# EAGLE design ADC Arduino Uno Shield (EAGLE 9.6.2)
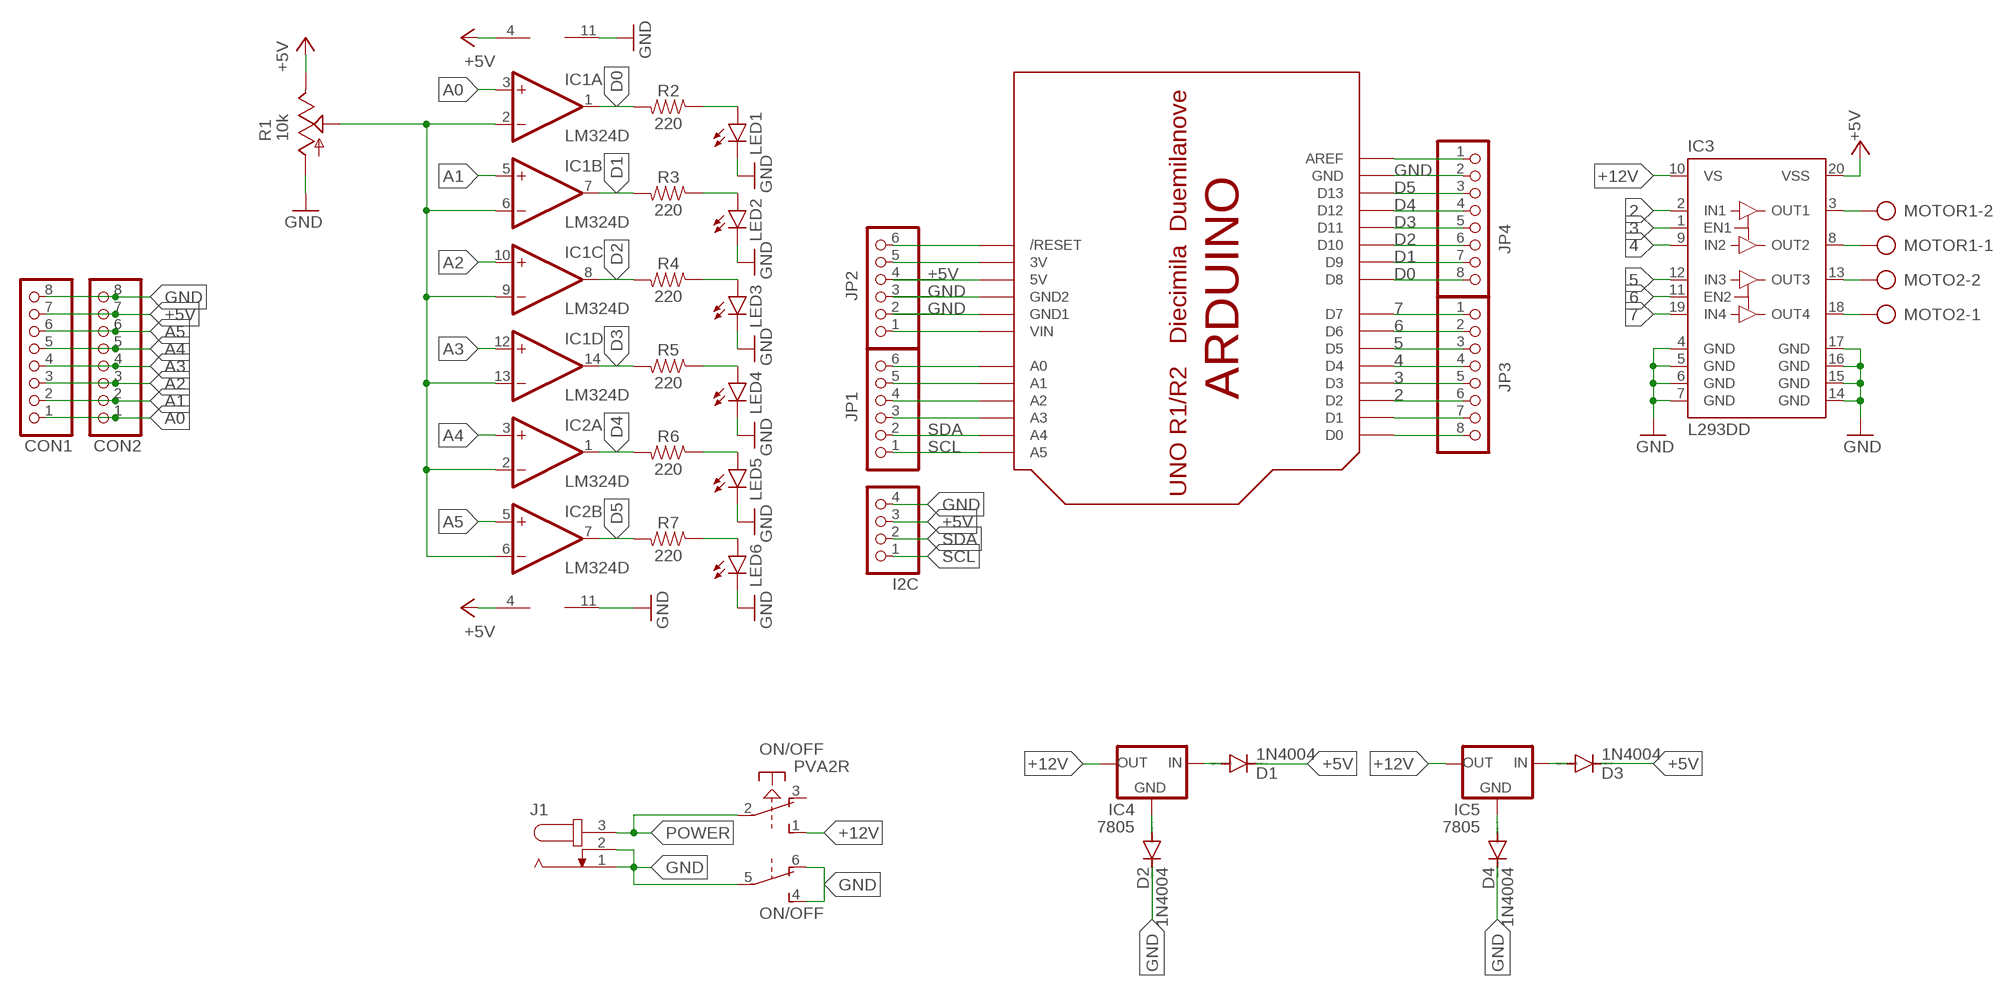
[diagram p0: schematic, sheet 1]

## Parts
CON1  PINHD-1X8  [1X08]
CON2  PINHD-1X8  [1X08]
D1  1N4004  [DO41-10]
D2  1N4004  [DO41-10]
D3  1N4004  [DO41-10]
D4  1N4004  [DO41-10]
I2C  PINHD-1X4  [1X04]
IC1  LM324D  [SO14]
IC2  LM324D  [SO14]
IC3  L293DD  [SO20]
IC4  7805  78XXS  [78XXS]
IC5  7805  78XXS  [78XXS]
J1  JACK-PLUG0  [SPC4077]
JP1  PINHD-1X6  [1X06]
JP2  PINHD-1X6  [1X06]
JP3  PINHD-1X8  [1X08]
JP4  PINHD-1X8  [1X08]
LED1  LEDSML0805  [SML0805]
LED2  LEDSML0805  [SML0805]
LED3  LEDSML0805  [SML0805]
LED4  LEDSML0805  [SML0805]
LED5  LEDSML0805  [SML0805]
LED6  LEDSML0805  [SML0805]
MOTO2  AK500/2-H  [AK500/2-H]
MOTOR1  AK500/2-H  [AK500/2-H]
ON/OFF  PVA2R  [PVA2R]
R1  10k  TRIM_US-CA9V  [CA9V]
R2  220  RESISTOR1206  [1206]
R3  220  RESISTOR1206  [1206]
R4  220  RESISTOR1206  [1206]
R5  220  RESISTOR1206  [1206]
R6  220  RESISTOR1206  [1206]
R7  220  RESISTOR1206  [1206]
U$2  ARDUINO-NODIM  [ARDUINO-NODIM]

## Nets
2: IC3.2(IN1) JP3.6 U$2.D2
3: IC3.1(EN1) JP3.5 U$2.D3
4: IC3.9(IN2) JP3.4 U$2.D4
5: IC3.12(IN3) JP3.3 U$2.D5
6: IC3.11(EN2) JP3.2 U$2.D6
7: IC3.19(IN4) JP3.1 U$2.D7
+5V: CON1.7 CON2.7 D1.C D3.C I2C.3 IC1.4(P:V+) IC2.4(P:V+) IC3.20(VSS) JP2.4 R1.E U$2.5V
+12V: IC3.10(VS) IC4.OUT IC5.OUT ON/OFF.1(1:S)
A0: CON1.1 CON2.1 IC1.3(A:+IN)
A1: CON1.2 CON2.2 IC1.5(B:+IN)
A2: CON1.3 CON2.3 IC1.10(C:+IN)
A3: CON1.4 CON2.4 IC1.12(D:+IN)
A4: CON1.5 CON2.5 IC2.3(A:+IN)
A5: CON1.6 CON2.6 IC2.5(B:+IN)
D0: IC1.1(A:OUT) JP4.8 R2.2 U$2.D8
D1: IC1.7(B:OUT) JP4.7 R3.2 U$2.D9
D2: IC1.8(C:OUT) JP4.6 R4.2 U$2.D10
D3: IC1.14(D:OUT) JP4.5 R5.2 U$2.D11
D4: IC2.1(A:OUT) JP4.4 R6.2 U$2.D12
D5: IC2.7(B:OUT) JP4.3 R7.2 U$2.D13
GND: CON1.8 CON2.8 D2.C D4.C I2C.4 IC1.11(P:V-) IC2.11(P:V-) IC3.4(GND) IC3.5(GND) IC3.6(GND) IC3.7(GND) IC3.14(GND) IC3.15(GND) IC3.16(GND) IC3.17(GND) J1.1 J1.2 JP2.2 JP2.3 JP4.2 LED1.C LED2.C LED3.C LED4.C LED5.C LED6.C ON/OFF.4(2:S) ON/OFF.5(2:P) ON/OFF.6(2:O) R1.A U$2.GND U$2.GND1 U$2.GND2
N$1: D1.A IC4.IN
N$2: JP1.3 U$2.A3
N$3: D2.A IC4.GND
N$4: D3.A IC5.IN
N$5: D4.A IC5.GND
N$6: JP1.4 U$2.A2
N$7: LED1.A R2.1
N$8: LED2.A R3.1
N$9: LED3.A R4.1
N$10: LED4.A R5.1
N$11: LED5.A R6.1
N$12: LED6.A R7.1
N$13: IC1.2(A:-IN) IC1.6(B:-IN) IC1.9(C:-IN) IC1.13(D:-IN) IC2.2(A:-IN) IC2.6(B:-IN) R1.S
N$14: JP1.5 U$2.A1
N$15: IC3.3(OUT1) MOTOR1.2
N$16: IC3.8(OUT2) MOTOR1.1
N$17: IC3.13(OUT3) MOTO2.2
N$18: IC3.18(OUT4) MOTO2.1
N$19: JP1.6 U$2.A0
N$21: JP4.1 U$2.AREF
N$22: JP3.7 U$2.D1
N$23: JP3.8 U$2.D0
POWER: J1.3 ON/OFF.2(1:P)
SCL: I2C.1 JP1.1 U$2.A5
SDA: I2C.2 JP1.2 U$2.A4
U$2_3V: JP2.5 U$2.3V
U$2_/RESET: JP2.6 U$2.RESET(/RESET)
U$2_VIN: JP2.1 U$2.VIN
Unconnected: IC2.8(C:OUT) IC2.9(C:-IN) IC2.10(C:+IN) IC2.12(D:+IN) IC2.13(D:-IN) IC2.14(D:OUT) ON/OFF.3(1:O)

## Library data of the parts
CON1 CON2 = Connector:PINHD-1X8: PIN HEADER; CATEGORY: CONNECTOR; SUB-CATEGORY: PIN-HEADER
D1-D4 = diode:1N4004: DIODE general purpose rectifier, 1 A
I2C = Connector:PINHD-1X4: PIN HEADER; CATEGORY: CONNECTOR; SUB-CATEGORY: PIN-HEADER
IC1 IC2 = linear:LM324: OP AMP
IC3 = st-microelectronics:L293DD: PUSH-PULL FOUR CHANNEL DRIVER WITH DIODES Source: http://www.st.com/stonline/books/pdf/docs/1330.pdf; OC_FARNELL: unknown
IC4 IC5 = v-reg:78XXS: VOLTAGE REGULATOR
J1 = con-jack:JACK-PLUG: DC POWER JACK Power Jack, DC, Right Angle, Through Hole, Rated 5A at 16VDC, PC Terminals Distributor: Farnell (www.Farnell.de) Drawing: 84N1161.pdf / 84N1162.pdf Manufacturer: SPC Technology (www.spctechnology.com) Type: SPC4077 / SPC 4078; OC_FARNELL: unknown; OC_NEWARK: unknown
JP1 JP2 = pinhead:PINHD-1X6: PIN HEADER
JP3 JP4 = pinhead:PINHD-1X8: PIN HEADER
LED1-LED6 = led:LED: LED OSRAM: - CHIPLED LG R971, LG N971, LY N971, LG Q971, LY Q971, LO R971, LY R971 LH N974, LH R974 LS Q976, LO Q976, LY Q976 LO Q996 - Hyper CHIPLED LW Q18S LB Q993, LB Q99A, LB R99A - SideLED LS A670, LO A670, LY A670, LG A670, LP A670 LB A673, LV A673, LT A673, LW A673 LH A674 LY A675 LS A676, LA A676, LO A676, LY A676, LW A676 LS A679, LY A679, LG A679 - Hyper Micro SIDELED® LS Y876, LA Y876, LO Y876, LY Y876 LT Y87S - SmartLED LW L88C, LW L88S LB L89C, LB L89S, LG L890 LS L89K, LO L89K, LY L89K LS L896, LA L896, LO L896, LY L896 - TOPLED LS T670, LO T670, LY T670, LG T670, LP T670 LSG T670, LSP T670, LSY T670, LOP T670, LYG T670 LG T671, LOG T671, LSG T671 LB T673, LV T673, LT T673, LW T673 LH T674 LS T676, LA T676, LO T676, LY T676, LB T676, LH T676, LSB T676, LW T676 LB T67C, LV T67C, LT T67C, LS T67K, LO T67K, LY T67K, LW E67C LS E67B, LA E67B, LO E67B, LY E67B, LB E67C, LV E67C, LT E67C LW T67C LS T679, LY T679, LG T679 LS T770, LO T770, LY T770, LG T770, LP T770 LB T773, LV T773, LT T773, LW T773 LH T774 LS E675, LA E675, LY E675, LS T675 LS T776, LA T776, LO T776, LY T776, LB T776 LHGB T686 LT T68C, LB T68C - Hyper Mini TOPLED® LB M676 - Mini TOPLED Santana® LG M470 LS M47K, LO M47K, LY M47K Source: http://www.osram.convergy.de LUXEON: - LUMILED® LXK2-PW12-R00, LXK2-PW12-S00, LXK2-PW14-U00, LXK2-PW14-V00 LXK2-PM12-R00, LXK2-PM12-S00, LXK2-PM14-U00 LXK2-PE12-Q00, LXK2-PE12-R00, LXK2-PE12-S00, LXK2-PE14-T00, LXK2-PE14-U00 LXK2-PB12-K00, LXK2-PB12-L00, LXK2-PB12-M00, LXK2-PB14-N00, LXK2-PB14-P00, LXK2-PB14-Q00 LXK2-PR12-L00, LXK2-PR12-M00, LXK2-PR14-Q00, LXK2-PR14-R00 LXK2-PD12-Q00, LXK2-PD12-R00, LXK2-PD12-S00 LXK2-PH12-R00, LXK2-PH12-S00 LXK2-PL12-P00, LXK2-PL12-Q00, LXK2-PL12-R00 Source: www.luxeon.com KINGBRIGHT: KA-3528ASYC Source: www.kingbright.com
MOTO2 MOTOR1 = con-ptr500:AK500/2-H: CONNECTOR Aug. 2004 / PTR Meßtechnik: Die Bezeichnung der Serie AK505 wurde geändert. Es handelt sich hierbei um AK500 in horizontaler Ausführung.; OC_FARNELL: unknown; OC_NEWARK: unknown
ON/OFF = switch-misc:PVA2R: ITT SWITCH
R1 = pot:TRIM_US-: POTENTIOMETER
R2-R7 = SparkFun-Resistors:RESISTOR: Generic Resistor Package
U$2 = adafruit:ARDUINO: Arduino Diecimila/Duemilanove Make a shield with ease, this package has all the named pins as well as the two mounting drill holes and an outline of the USB and DC power connector. The outline is on the DIMENSION layer, so if your board house uses it they will cut the outline to match. http://www.ladyada.net/library/pcb/eaglelibrary.html

## Board
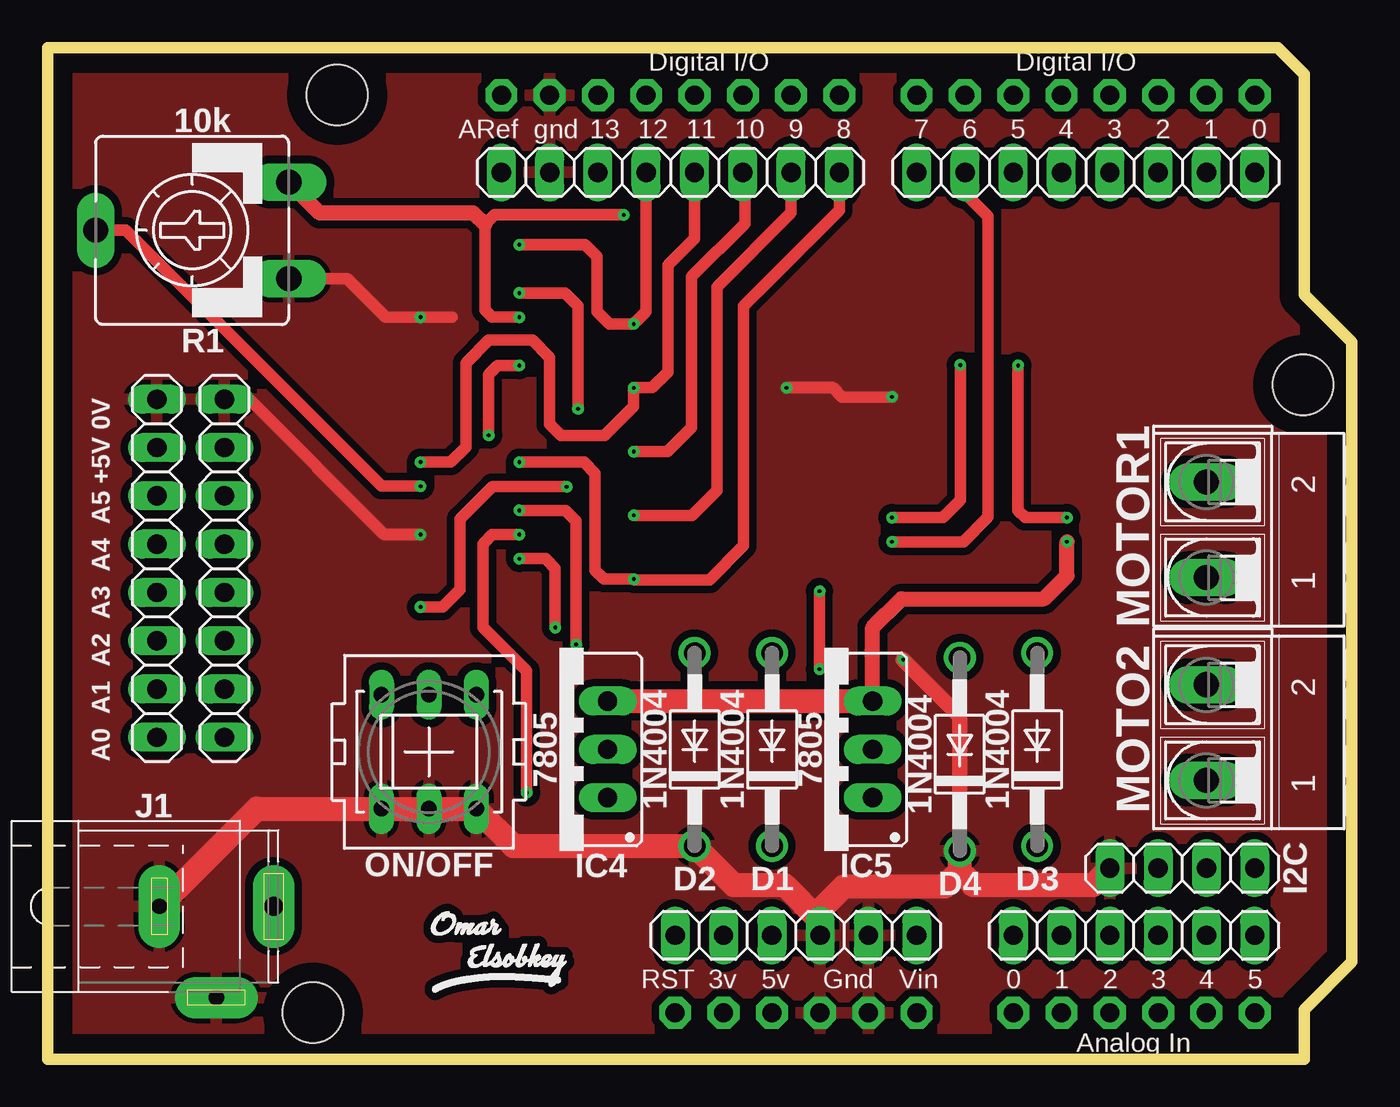
[diagram p1: board, top side]
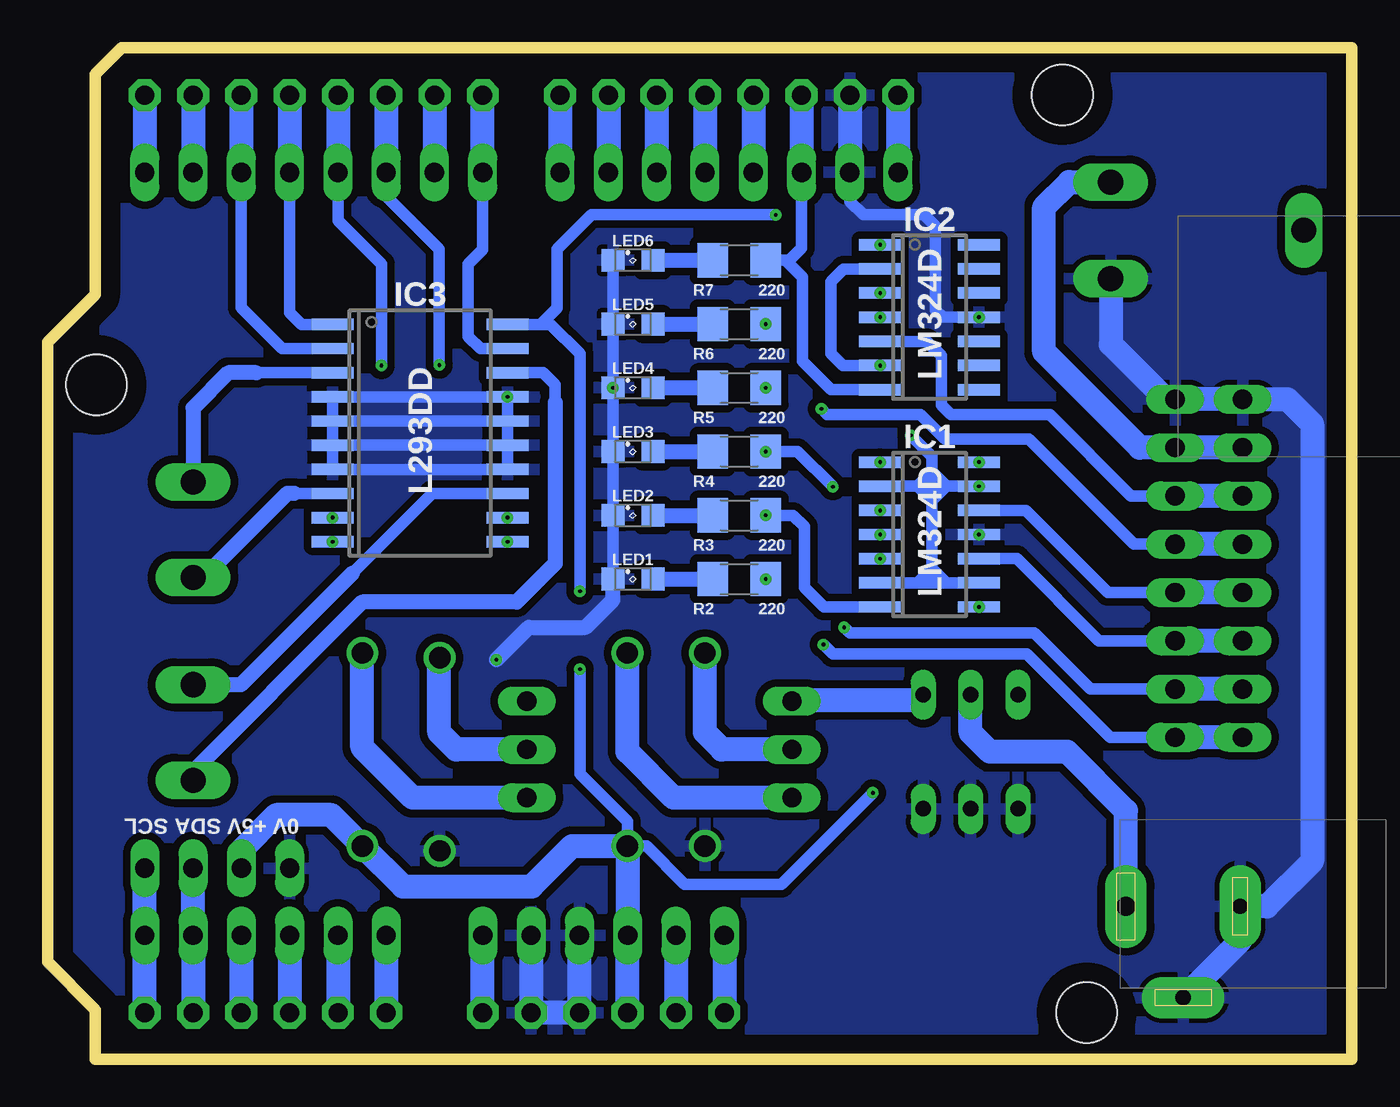
[diagram p2: board, bottom side, seen from below]

Size 68.6 x 53.2 mm. Coordinates in mm from the lower left corner, seen from the top.
Outline: 0,53.2 64.7,53.2 66.1,51.8 66.1,40.2 68.6,37.7 68.6,5.1 66.1,2.6 66.1,0 0,0 0,53.2
Copper layers (1*16): Top 0.035mm / dielectric 1.5mm / Bottom 0.035mm
Design rules "default *": minimum track width 0.6mm, minimum drill 0.2mm, track to track 0.4mm, track to pad 0.4mm, pad to pad 0.4mm, via to via 0.4mm, smd to smd 0.4mm, copper to edge 40mil, drill to drill 6mil, minimum pad ring 10mil, minimum via ring 8mil, stop-mask expansion 4mil, vias tented up to drill 0mil, thermal gap 10mil

### Footprints (pad centres in the part's own frame; a part is rotated, then mirrored left to right if it is on the bottom)
1X08 = drill 1.016 long: 1 -8.89,0; 2 -6.35,0; 3 -3.81,0; 4 -1.27,0; 5 1.27,0; 6 3.81,0; 7 6.35,0; 8 8.89,0
DO41-10 = drill 1.118: A 5.08,0; C -5.08,0
1X04 = drill 1.016 long: 1 -3.81,0; 2 -1.27,0; 3 1.27,0; 4 3.81,0
SO14 = smd 0.6 x 2.2: 1 -3.81,-2.6; 2 -2.54,-2.6; 3 -1.27,-2.6; 4 0,-2.6; 5 1.27,-2.6; 6 2.54,-2.6; 7 3.81,-2.6; 8 3.81,2.6; 9 2.54,2.6; 10 1.27,2.6; 11 0,2.6; 12 -1.27,2.6; 13 -2.54,2.6; 14 -3.81,2.6
SO20 = smd 0.6 x 2.2: 1 -5.715,-4.6; 2 -4.445,-4.6; 3 -3.175,-4.6; 4 -1.905,-4.6; 5 -0.635,-4.6; 6 0.635,-4.6; 7 1.905,-4.6; 8 3.175,-4.6; 9 4.445,-4.6; 10 5.715,-4.6; 11 5.715,4.6; 12 4.445,4.6; 13 3.175,4.6; 14 1.905,4.6; 15 0.635,4.6; 16 -0.635,4.6; 17 -1.905,4.6; 18 -3.175,4.6; 19 -4.445,4.6; 20 -5.715,4.6
78XXS = drill 1.016 long: GND 0,-2.54; IN -2.54,-2.54; OUT 2.54,-2.54
SPC4077 = drill 0.8 pad 2.184 long: 1 -3,0; 2 0,-4.8 | drill 1 pad 2.184 long: 3 3,0
1X06 = drill 1.016 long: 1 -6.35,0; 2 -3.81,0; 3 -1.27,0; 4 1.27,0; 5 3.81,0; 6 6.35,0
SML0805 = smd 1.2 x 1.2: A 1.05,0; C -1.05,0
AK500/2-H = drill 1.321 long: 1 -2.515,0; 2 2.515,0
PVA2R = drill 0.813 long: 1 -2.997,2.489; 2 -2.997,0; 3 -2.997,-2.489; 4 2.997,2.489; 5 2.997,0; 6 2.997,-2.489
CA9V = drill 1.321 long: A -2.54,-5.08; E 2.54,-5.08; S 0,5.08
1206 = smd 1.6 x 1.8: 1 -1.4,0; 2 1.4,0
ARDUINO-NODIM = drill 1 pad 1.676 octagon: 3V 35.56,2.54; 5V 38.1,2.54; A0 50.8,2.54; A1 53.34,2.54; A2 55.88,2.54; A3 58.42,2.54; A4 60.96,2.54; A5 63.5,2.54; AREF 23.876,50.8; D0 63.5,50.8; D1 60.96,50.8; D2 58.42,50.8; D3 55.88,50.8; D4 53.34,50.8; D5 50.8,50.8; D6 48.26,50.8; D7 45.72,50.8; D8 41.656,50.8; D9 39.116,50.8; D10 36.576,50.8; D11 34.036,50.8; D12 31.496,50.8; D13 28.956,50.8; GND 26.416,50.8; GND1 43.18,2.54; GND2 40.64,2.54; RESET 33.02,2.54; VIN 45.72,2.54 | hole 3.2: 15.24,50.8; 66.04,35.56; 13.97,2.54

### Placement (x,y rotation side)
CON1  5.75,25.81 90 top
CON2  9.3,25.81 90 top
D1  38.11,16.28 90 top
D2  34.03,16.28 90 top
D3  52.04,16.28 90 top
D4  47.97,16.03 90 top
I2C  59.68,10.03 180 top
IC1  22.22,27.59 270 bottom
IC2  22.22,39.02 270 bottom
IC3  49.01,32.92 270 bottom
IC4  26.91,16.28 90 top
IC5  40.85,16.28 90 top
J1  8.88,8.03 0 top
JP1  57.14,6.5 180 top
JP2  39.36,6.5 180 top
JP3  54.6,46.64 0 top
JP4  32.76,46.64 0 top
LED1  37.81,25.24 0 bottom
LED2  37.81,28.6 0 bottom
LED3  37.81,31.95 0 bottom
LED4  37.81,35.3 0 bottom
LED5  37.81,38.66 0 bottom
LED6  37.81,42.01 0 bottom
MOTO2  60.95,17.17 90 top
MOTOR1  60.95,27.84 90 top
ON/OFF  20.06,16.16 270 top
R1  7.61,43.59 90 top
R2  32.23,25.24 0 bottom
R3  32.23,28.6 0 bottom
R4  32.23,31.95 0 bottom
R5  32.23,35.3 0 bottom
R6  32.23,38.66 0 bottom
R7  32.23,42.01 0 bottom
U$2  -0.01,-0.1 0 top
U$3  [OMAR_ELSOBKEY_X0.5]  23.38,5.44 0 top

### Tracks (layer width: path | path; a pad name or v marks a point on that pad's centre or on a via)
2
  Bottom 0.6: IC3.2 56.25,37.37 58.41,39.52 JP3.6 58.41,46.89
  Bottom 0.8: U$2.D2 JP3.6
  Bottom 1.27: U$2.D2 58.41,46.89
3
  Bottom 0.6: 55.87,46.89 JP3.5 55.87,39.27 55.23,38.64 IC3.1
  Bottom 0.8: U$2.D3 JP3.5
  Bottom 1.27: U$2.D3 55.87,46.89
4  (via drill 0.2)
  Top 0.6: v51.04,36.48 51.04,28.86 51.42,28.48 IC3.9
  Bottom 0.6: 53.33,46.89 JP3.4 53.33,44.1 51.04,41.81 v51.04,36.48
  Bottom 0.8: U$2.D4 JP3.4
  Bottom 1.27: U$2.D4 53.33,46.89
  other vias: 53.61,28.48
5  (via drill 0.2)
  Top 0.6: v48,36.5 48,29.4 47.08,28.48 IC3.12
  Bottom 0.6: JP3.3 50.79,45.39 48,42.6 v48,36.5
  Bottom 0.8: U$2.D5 JP3.3
  Bottom 1.27: U$2.D5 50.79,46.89
  other vias: 44.41,28.48
6  (via drill 0.2)
  Top 0.6: JP3.2 48.25,45.54 49.45,44.34 49.45,28.5 48.15,27.21 IC3.11
  Bottom 0.8: U$2.D6 JP3.2
  Bottom 1.27: U$2.D6 48.25,46.89
  other vias: 44.41,27.21
7
  Bottom 0.6: IC3.19 45.84,37.37 46.47,38 46.47,41.81 45.71,42.57 45.71,46.89
  Bottom 0.8: U$2.D7 JP3.1
  Bottom 1.27: 45.71,46.89 U$2.D7
+5V  (via drill 0.2)
  Top 0.6: v30.3,44.4 23.5,44.4 23,43.9 23,39.4 23.38,39.02 IC2.4 | IC1.4 23.39,27.59 22.9,27.1 22.9,22.7 25.2,20.4 v25.2,14 | v40.6,24.6 v40.6,20.5
  Top 0.8: R1.E 14.32,44.5 22.4,44.5 23,43.9
  Bottom 0.6: IC3.20 42.66,38.64 | v30.3,44.4 40,44.4 41.8,42.6 41.8,39.5 42.66,38.64 | v25.2,14 30,9.2 35.1,9.2 37.1,11.2 D1.C 38.11,12.51 40.6,15 v40.6,20.5 | 42.66,38.64 42.13,38.64 40.6,37.1 v40.6,24.6
  Bottom 0.8: 57.5,11.9 58.4,11
  Bottom 1.27: CON1.7 CON2.7 11.16,32.16 16.2,37.2 16.2,44.8 14.87,46.13 R1.E | U$2.5V JP2.4 38.11,6.52 D1.C 41.01,11.2 43.14,9.07 49.91,9.07 D3.C 53.67,12.83 56.57,12.83 58.4,11 58.4,10.04 I2C.3
  other vias: 24.81,39.02 24.81,27.59
+12V  (via drill 0.2)
  Top 0.8: IC5.OUT 43.39,22.69 44.9,24.2 52.4,24.2 53.61,25.41 IC3.10
  Top 1.27: IC4.OUT IC5.OUT
  Bottom 1.27: ON/OFF.1 22.8,18.9 29.38,18.9 IC4.OUT
  other vias: 53.61,27.21
A0  (via drill 0.2)
  Top 0.6: v27.8,21.8 27.8,28.3 27.24,28.86 IC1.3
  Bottom 0.6: CON2.1 12.72,16.92 17.1,21.3 27.3,21.3 v27.8,21.8
  Bottom 1.27: CON1.1 CON2.1
  other vias: 24.81,28.86
A1  (via drill 0.2)
  Top 0.6: v26.7,22.7 26.7,25.8 26.18,26.32 IC1.5
  Bottom 0.6: CON2.2 13.76,19.46 16.7,22.4 26.4,22.4 v26.7,22.7
  Bottom 1.27: CON1.2 CON2.2
  other vias: 24.81,26.32
A2
  Bottom 0.6: CON2.3 13.3,22 17.62,26.32 IC1.10
  Bottom 1.27: CON1.3 CON2.3
A3
  Bottom 0.6: IC1.12 17.16,28.86 12.84,24.54 CON2.4
  Bottom 1.27: CON1.4 CON2.4
A4  (via drill 0.2)
  Top 0.6: v27.9,34.2 27.9,39.6 27.21,40.29 IC2.3
  Bottom 0.6: CON2.5 11.48,27.08 17,32.6 21.4,32.6 22.7,33.9 27.6,33.9 v27.9,34.2
  Bottom 1.27: CON1.5 CON2.5
  other vias: 24.81,40.29
A5
  Bottom 0.6: CON2.6 11.62,29.62 15.9,33.9 21.1,33.9 21.6,34.4 21.6,37 22.35,37.75 IC2.5
  Bottom 1.27: CON1.6 CON2.6
D0  (via drill 0.2)
  Top 0.6: JP4.8 41.65,44.65 36.6,39.6 36.6,27 34.8,25.2 30.87,25.2 R2.2 29.26,25.24 28.8,25.7 28.8,30.8 28.2,31.4 IC1.1
  Bottom 1.27: U$2.D8 JP4.8
  other vias: 30.83,25.24 24.81,31.4
D1  (via drill 0.2)
  Top 0.6: JP4.7 39.11,44.51 35.2,40.6 35.2,29.9 33.9,28.6 R3.2
  Bottom 0.6: R3.2 29.4,28.6 28.8,28 28.8,24.8 27.78,23.78 IC1.7
  Bottom 1.27: U$2.D9 JP4.7
  other vias: 30.83,28.6
D2  (via drill 0.2)
  Top 0.6: JP4.6 36.67,46.54 36.67,43.94 33.87,41.14 33.87,33.22 32.6,31.95 R4.2 | v19.61,23.78 20.78,23.78 21.7,24.7 21.7,28.4 23.4,30.1 v27.3,30.1
  Bottom 0.6: v27.3,30.1 29.15,31.95 R4.2
  Bottom 1.27: U$2.D10 JP4.6
  other vias: 30.83,31.95
D3  (via drill 0.2)
  Top 0.6: JP4.5 34.03,43.14 32.63,41.74 32.63,36.13 31.8,35.3 R5.2 30.83,34.33 29.3,32.8 27,32.8 26.4,33.4 26.4,36.9 25.5,37.8 23.2,37.8 22,36.6 22,32.2 21.2,31.4 v19.61,31.4
  Bottom 1.27: U$2.D11 JP4.5
  other vias: 30.83,35.3
D4  (via drill 0.2)
  Top 0.6: JP4.4 31.49,39.31 R6.2 29.55,38.66 28.9,39.3 28.9,42.2 28.27,42.83 IC2.1
  Bottom 1.27: U$2.D12 JP4.4
  other vias: 30.83,38.66 24.81,42.83
D5
  Bottom 0.6: R7.2 29.79,42.01 | 29.79,42.01 29.59,42.01 28.95,42.65 JP4.3 | 29.79,42.01 28.9,41.12 28.9,36.7 27.41,35.21 IC2.7
  Bottom 1.27: U$2.D13 JP4.3
GND  (via drill 0.2)
  Top 0.6: IC3.17 41.77,34.83 41.3,35.3 LED4.C | R1.A 15.75,41.05 17.78,39.02 v19.61,39.02 21.28,39.02 | v19.61,27.59 IC1.11 17.7,27.6 10.6,34.7 CON2.8
  Top 0.8: D4.C 47.97,18.03 v45,21
  Top 1.27: J1.1 11.01,13.16 ON/OFF.6 ON/OFF.5 ON/OFF.4 24.5,11.2 D2.C 36.08,9.15 38.75,9.15 40.63,7.27 JP2.3 40.63,7.83 41.88,9.08 47.18,9.08 47.97,9.87 | 47.97,9.87 D4.C | 47.97,9.87 48.69,9.16 54.99,9.16 I2C.4
  Bottom 0.6: 38.86,31.59 LED3.C | IC3.16 IC3.15 | IC3.16 IC3.5 | IC3.15 IC3.6 | IC3.16 IC3.17 IC3.4 IC3.5 | IC3.5 IC3.6 | IC3.15 IC3.14 IC3.7 IC3.6 | LED6.C LED5.C LED4.C LED3.C | JP4.2 26.41,45.11 25.7,44.4 22.5,44.4 21.9,43.8 21.9,39.4 21.52,39.02 v19.61,39.02 | LED3.C LED2.C LED1.C
  Bottom 0.8: JP2.2 U$2.GND1 | v45,21 43.3,22.7 40.3,22.7 38.86,24.14 LED1.C
  Bottom 1.27: J1.2 5.88,6.23 J1.1 4.47,8.03 2.1,10.4 2.1,33.4 3.4,34.7 CON1.8 CON2.8 9.8,34.7 12.69,37.59 R1.A | JP2.3 U$2.GND2 U$2.GND1 43.17,6.25 | U$2.GND JP4.2
  other vias: 44.41,34.83 38.86,35.3
  pour Top: 0,53.2 64.7,53.2 66.1,51.8 66.1,40.2 68.6,37.7 68.6,37.6 68.6,5.1 66.1,2.6 66.1,0 0.1,0 0,0.1
  pour Bottom: 0,53.2 64.7,53.2 66.1,51.8 66.1,40.2 68.6,37.7 68.6,37.6 68.6,5.1 66.1,2.6 66.1,0 0.1,0 0,0.1
N$1
  Bottom 1.27: IC4.IN 35.68,13.74 38.11,16.17 D1.A
N$2
  Bottom 1.27: JP1.3 U$2.A3
N$3
  Bottom 1.27: IC4.GND 33.14,16.28 34.03,17.18 D2.A
N$4
  Bottom 1.27: IC5.IN 49.39,13.74 52.05,16.4 D3.A
N$5
  Bottom 1.27: IC5.GND 47.11,16.28 48,17.17 48,21.09 D4.A
N$6
  Bottom 1.27: JP1.4 U$2.A2
N$7
  Bottom 0.8: LED1.A R2.1
N$8
  Bottom 0.8: LED2.A R3.1
N$9
  Bottom 0.8: LED3.A R4.1
N$10
  Bottom 0.8: LED4.A R5.1
N$11
  Bottom 0.8: LED5.A R6.1
N$12
  Bottom 0.8: LED6.A R7.1
N$13  (via drill 0.2)
  Top 0.6: v19.61,30.13 17.57,30.13 4.11,43.59 R1.S | v23.2,32.8 23.2,36 23.68,36.48 IC2.6
  Bottom 0.6: v19.61,30.13 21.33,30.13 | 21.33,30.13 22.09,30.13 | 22.09,30.13 22.85,30.13 | 22.85,30.13 IC1.2 | IC1.6 22.85,25.05 | 22.85,25.05 22.09,25.05 | 22.09,25.05 21.33,25.05 | 21.33,25.05 IC1.9 | 22.09,29.36 22.09,30.13 | 22.09,29.36 22.09,25.81 | 22.09,25.05 22.09,25.81 | 22.85,30.13 22.09,29.36 | 22.09,29.36 21.33,30.13 | 22.09,25.81 21.33,25.05 | 22.09,25.81 22.85,25.05 | IC2.2 26.74,41.56 27.4,40.9 27.4,37.1 26.78,36.48 IC2.6 | 22.09,30.13 22.09,30.89 | 22.09,30.9 22.09,31.69 v23.2,32.8 | 22.09,30.89 22.09,30.9 | 22.09,30.89 21.33,30.13 | 22.09,30.9 22.85,30.14 22.85,30.13
  other vias: 24.81,36.48
N$14
  Bottom 1.27: JP1.5 U$2.A1
N$15
  Bottom 0.6: IC3.3 57.62,36.09
  Bottom 0.8: 57.62,36.09 59.1,36.09 60.95,34.24 MOTOR1.2
N$16
  Bottom 0.6: IC3.8 55.62,29.75
  Bottom 0.8: MOTOR1.1 60.42,25.32 56,29.75 55.62,29.75
N$17
  Bottom 0.6: IC3.13 48.38,29.75 52.57,25.55
  Bottom 0.8: MOTO2.2 58.44,19.69 52.57,25.55
N$18
  Bottom 0.6: IC3.18 42.53,36.09 41.9,35.46 41.9,34.55
  Bottom 0.8: MOTO2.1 60.95,15.14 52.68,23.41 52.06,24.03 43.93,24.03 41.9,26.06 41.9,34.55
N$19
  Bottom 1.27: JP1.6 U$2.A0
N$21
  Bottom 1.27: U$2.AREF JP4.1
N$22
  Bottom 0.8: U$2.D1 JP3.7
  Bottom 1.27: U$2.D1 60.95,46.89
N$23
  Bottom 0.8: U$2.D0 JP3.8
  Bottom 1.27: U$2.D0 63.49,46.89
POWER
  Bottom 1.27: J1.3 11.88,13.06 14.98,16.16 19.04,16.16 20.06,17.17 ON/OFF.2
SCL
  Bottom 1.27: U$2.A5 JP1.1 I2C.1
SDA
  Bottom 1.27: U$2.A4 JP1.2 I2C.2
U$2_3V
  Bottom 1.27: JP2.5 U$2.3V
U$2_/RESET
  Bottom 1.27: JP2.6 U$2.RESET
U$2_VIN
  Bottom 0.8: JP2.1 U$2.VIN
  Bottom 1.27: U$2.VIN 45.71,6.25

### Text on the board
tNames: A0 A1 A2 A3 A4 A5 +5V 0V
bNames: 0V +5V SDA SCL